# EAGLE design 12-bit-asm (EAGLE 8.3.1)
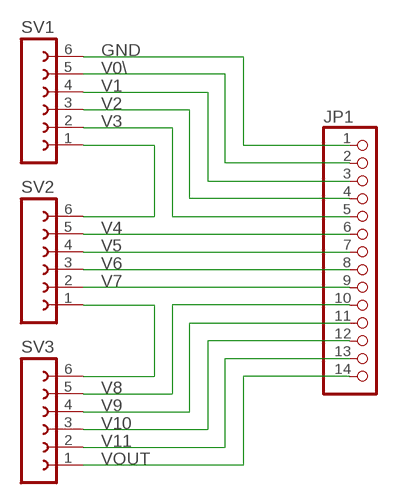
[diagram p0: schematic, sheet 1]

## Parts
JP1  PINHD-1X14  [1X14]
SV1  FE06-1  [FE06]
SV2  FE06-1  [FE06]
SV3  FE06-1  [FE06]

## Nets
GND: JP1.1 SV1.6
N$2: SV1.1 SV2.6
N$12: SV2.1 SV3.6
V0\: JP1.2 SV1.5
V1: JP1.3 SV1.4
V2: JP1.4 SV1.3
V3: JP1.5 SV1.2
V4: JP1.6 SV2.5
V5: JP1.7 SV2.4
V6: JP1.8 SV2.3
V7: JP1.9 SV2.2
V8: JP1.10 SV3.5
V9: JP1.11 SV3.4
V10: JP1.12 SV3.3
V11: JP1.13 SV3.2
VOUT: JP1.14 SV3.1

## Library data of the parts
JP1 = pinhead:PINHD-1X14: PIN HEADER
SV1-SV3 = con-lsta:FE06-1: FEMALE HEADER; OC_FARNELL: unknown; OC_NEWARK: unknown

## Board
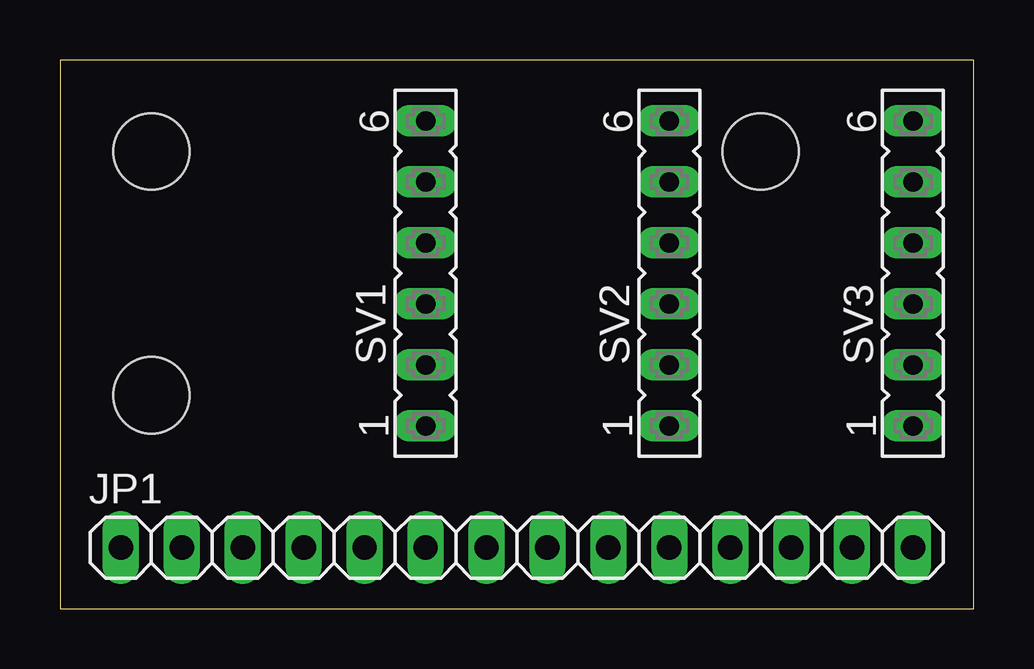
[diagram p1: board, top side]
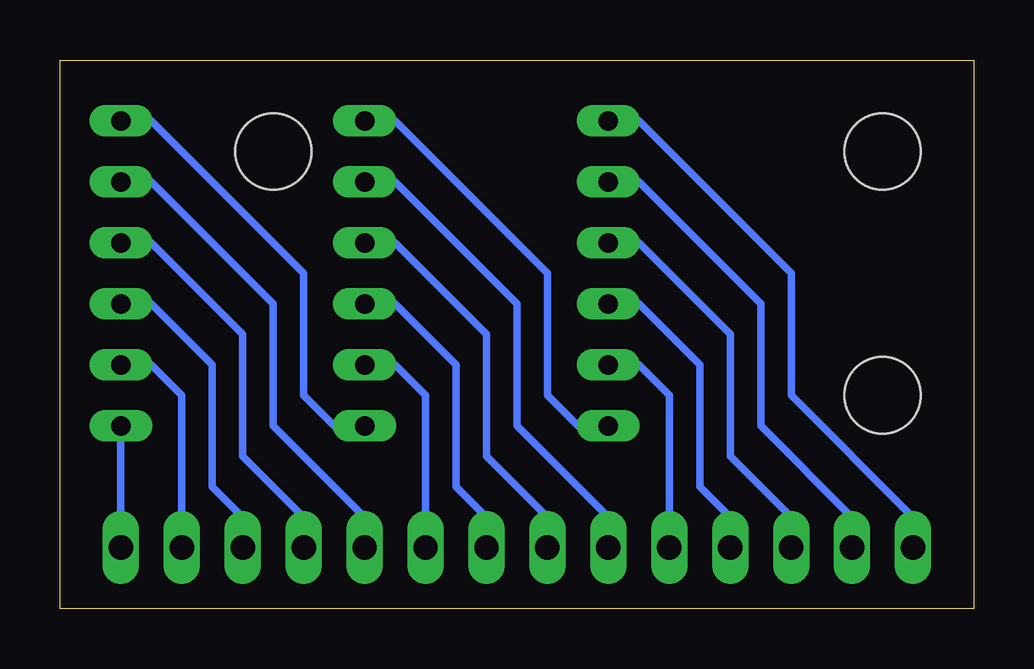
[diagram p2: board, bottom side, seen from below]

Size 38.1 x 22.86 mm. Coordinates in mm from the lower left corner, seen from the top.
Outline: 0,0 38.1,0 38.1,22.86 0,22.86 0,0
Copper layers (1*16): Top 0.035mm / dielectric 1.5mm / Bottom 0.035mm
Design rules "default": minimum track width 6mil, minimum drill 0.35mm, track to track 6mil, track to pad 6mil, pad to pad 6mil, via to via 6mil, smd to smd 6mil, copper to edge 40mil, drill to drill 6mil, minimum pad ring 10mil, minimum via ring 8mil, stop-mask expansion 4mil, vias tented up to drill 0mil, thermal gap 10mil
Holes 3.17 mm at 3.81,19.05 3.81,8.89 29.21,19.05

### Footprints (pad centres in the part's own frame; a part is rotated, then mirrored left to right if it is on the bottom)
1X14 = drill 1.016 long: 1 -16.51,0; 2 -13.97,0; 3 -11.43,0; 4 -8.89,0; 5 -6.35,0; 6 -3.81,0; 7 -1.27,0; 8 1.27,0; 9 3.81,0; 10 6.35,0; 11 8.89,0; 12 11.43,0; 13 13.97,0; 14 16.51,0
FE06 = drill 0.813 long: 1 -6.35,0; 2 -3.81,0; 3 -1.27,0; 4 1.27,0; 5 3.81,0; 6 6.35,0

### Placement (x,y rotation side)
JP1  19.05,2.54 0 top
SV1  15.24,13.97 90 top
SV2  25.4,13.97 90 top
SV3  35.56,13.97 90 top

### Tracks (layer width: path | path; a pad name or v marks a point on that pad's centre or on a via)
GND
  Bottom 0.305: SV1.6 13.97,20.32 7.62,13.97 7.62,8.89 2.54,3.81 JP1.1
N$2
  Bottom 0.305: SV1.1 16.51,7.62 17.78,8.89 17.78,13.97 24.13,20.32 SV2.6
N$12
  Bottom 0.305: SV2.1 26.67,7.62 27.94,8.89 27.94,13.97 34.29,20.32 SV3.6
V0\
  Bottom 0.305: JP1.2 5.08,3.81 8.89,7.62 8.89,12.7 13.97,17.78 SV1.5
V1
  Bottom 0.305: SV1.4 13.97,15.24 10.16,11.43 10.16,6.35 7.62,3.81 JP1.3
V2
  Bottom 0.305: JP1.4 10.16,3.81 11.43,5.08 11.43,10.16 13.97,12.7 SV1.3
V3
  Bottom 0.305: JP1.5 12.7,8.89 13.97,10.16 SV1.2
V4
  Bottom 0.305: SV2.5 24.13,17.78 19.05,12.7 19.05,7.62 15.24,3.81 JP1.6
V5
  Bottom 0.305: JP1.7 17.78,3.81 20.32,6.35 20.32,11.43 24.13,15.24 SV2.4
V6
  Bottom 0.305: JP1.8 20.32,3.81 21.59,5.08 21.59,10.16 24.13,12.7 SV2.3
V7
  Bottom 0.305: JP1.9 22.86,8.89 24.13,10.16 SV2.2
V8
  Bottom 0.305: JP1.10 25.4,3.81 29.21,7.62 29.21,12.7 34.29,17.78 SV3.5
V9
  Bottom 0.305: SV3.4 34.29,15.24 30.48,11.43 30.48,6.35 27.94,3.81 JP1.11
V10
  Bottom 0.305: JP1.12 30.48,3.81 31.75,5.08 31.75,10.16 34.29,12.7 SV3.3
V11
  Bottom 0.305: JP1.13 33.02,8.89 34.29,10.16 SV3.2
VOUT
  Bottom 0.305: SV3.1 JP1.14